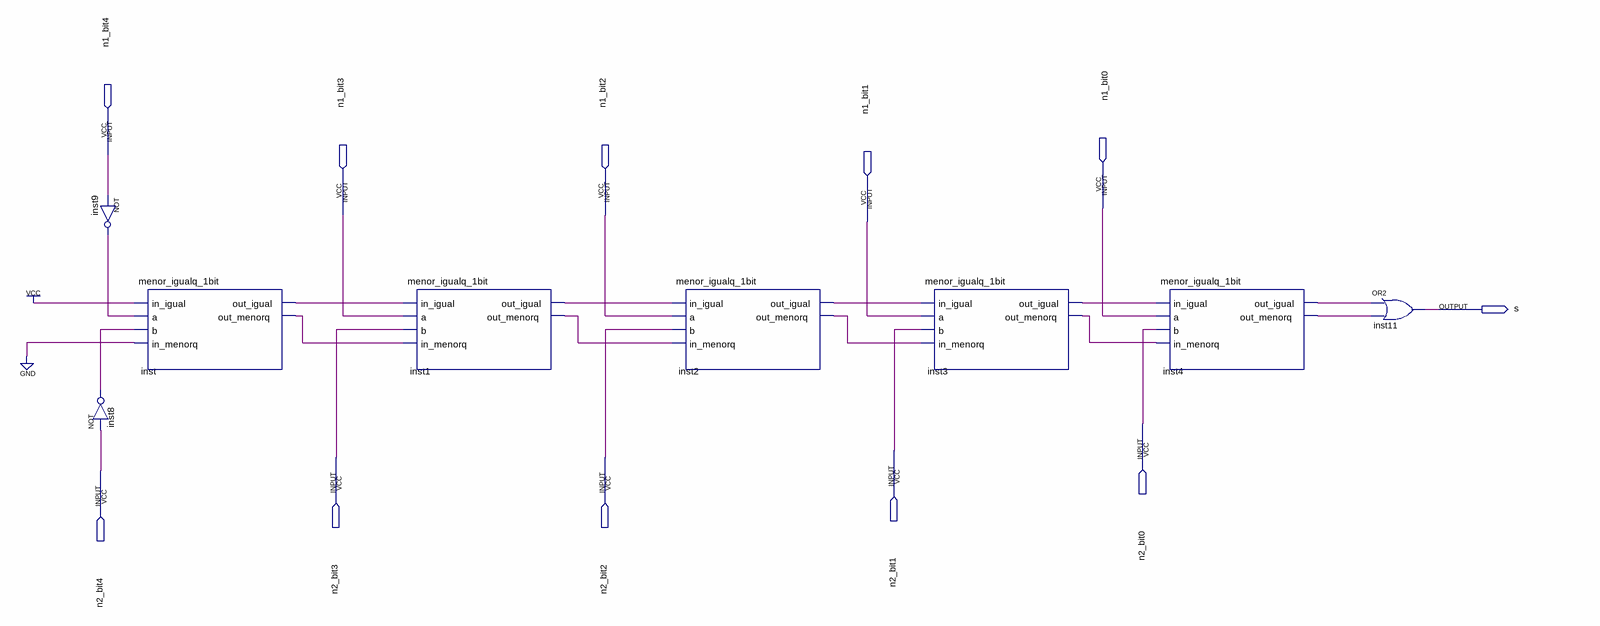
[diagram p0: schematic sheet]
// Quartus schematic menor_igualq_5bit.bdf as structural Verilog: 8 symbols, 11 pins
module menor_igualq_5bit (
  input  n1_bit4,
  input  n1_bit0,
  input  n1_bit3,
  input  n1_bit2,
  input  n1_bit1,
  input  n2_bit0,
  input  n2_bit1,
  input  n2_bit3,
  input  n2_bit2,
  input  n2_bit4,
  output s
);

  wire inst1_out_igual, inst1_out_menorq, inst2_out_igual, inst2_out_menorq, inst3_out_igual,
       inst3_out_menorq, inst4_out_igual, inst4_out_menorq, inst8_out, inst9_out, inst_out_igual,
       inst_out_menorq;

  not inst8 (inst8_out, n2_bit4);
  not inst9 (inst9_out, n1_bit4);
  menor_igualq_1bit inst (
    .in_igual(1'b1), .a(inst9_out), .b(inst8_out), .in_menorq(1'b0), .out_igual(inst_out_igual),
    .out_menorq(inst_out_menorq));
  menor_igualq_1bit inst1 (
    .in_igual(inst_out_igual), .a(n1_bit3), .b(n2_bit3), .in_menorq(inst_out_menorq),
    .out_igual(inst1_out_igual), .out_menorq(inst1_out_menorq));
  menor_igualq_1bit inst2 (
    .in_igual(inst1_out_igual), .a(n1_bit2), .b(n2_bit2), .in_menorq(inst1_out_menorq),
    .out_igual(inst2_out_igual), .out_menorq(inst2_out_menorq));
  menor_igualq_1bit inst3 (
    .in_igual(inst2_out_igual), .a(n1_bit1), .b(n2_bit1), .in_menorq(inst2_out_menorq),
    .out_igual(inst3_out_igual), .out_menorq(inst3_out_menorq));
  menor_igualq_1bit inst4 (
    .in_igual(inst3_out_igual), .a(n1_bit0), .b(n2_bit0), .in_menorq(inst3_out_menorq),
    .out_igual(inst4_out_igual), .out_menorq(inst4_out_menorq));
  or inst11 (s, inst4_out_igual, inst4_out_menorq);
endmodule
